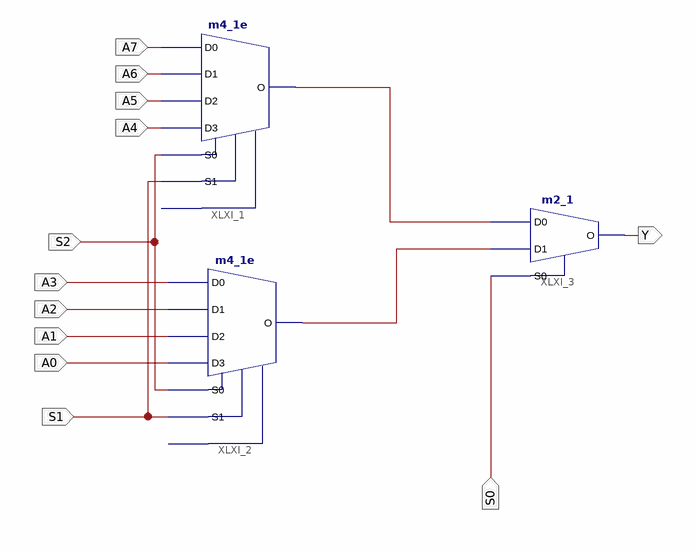
[diagram p0: schematic sheet 1]
// Xilinx ISE schematic mux8to1_2.sch (spartan3e) as structural Verilog: 3 symbols, 12 ports
module mux8to1_2 (
  input  S0,
  input  S1,
  input  A4,
  input  A5,
  input  A6,
  input  A7,
  input  S2,
  input  A3,
  input  A2,
  input  A1,
  input  A0,
  output Y
);

  wire XLXN_4, XLXN_5;

  m4_1e XLXI_1 (.D0(A7), .D1(A6), .D2(A5), .D3(A4), .S0(S2), .S1(S1), .O(XLXN_4));  // open: E
  m4_1e XLXI_2 (.D0(A3), .D1(A2), .D2(A1), .D3(A0), .S0(S2), .S1(S1), .O(XLXN_5));  // open: E
  m2_1 XLXI_3 (.D0(XLXN_4), .D1(XLXN_5), .S0(S0), .O(Y));
endmodule
